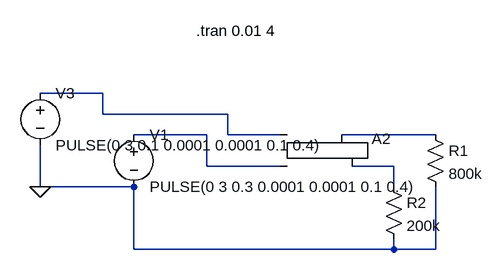
[diagram p0: schematic SRflipflop.asc]
SRflipflop.asc, the LTspice schematic file:
Version 4
SHEET 1 880 680
WIRE 32 128 -64 128
WIRE 32 160 32 128
WIRE 224 160 32 160
WIRE 192 192 80 192
WIRE 224 192 224 160
WIRE 304 192 224 192
WIRE 544 192 400 192
WIRE 192 240 192 192
WIRE 304 240 192 240
WIRE 480 240 416 240
WIRE -64 272 -64 208
WIRE 80 272 -64 272
WIRE 480 272 480 240
WIRE 80 368 80 272
WIRE 480 368 480 352
WIRE 480 368 80 368
WIRE 544 368 544 272
WIRE 544 368 480 368
FLAG -64 272 0
SYMBOL Digital/srflop 352 144 R0
SYMATTR InstName A2
SYMBOL voltage 80 176 R0
SYMATTR InstName V1
SYMATTR Value PULSE(0 3 0.3 0.0001 0.0001 0.1 0.4)
SYMBOL voltage -64 112 R0
SYMATTR InstName V3
SYMATTR Value PULSE(0 3 0.1 0.0001 0.0001 0.1 0.4)
SYMBOL res 528 176 R0
SYMATTR InstName R1
SYMATTR Value 800k
SYMBOL res 464 256 R0
SYMATTR InstName R2
SYMATTR Value 200k
TEXT 176 32 Left 2 !.tran 0.01 4

The netlist it stands for:
* SRflipflop.asc
A2 N001 N002 0 0 0 N004 N003 0 SRFLOP
V1 N002 0 PULSE(0 3 0.3 0.0001 0.0001 0.1 0.4)
V3 N001 0 PULSE(0 3 0.1 0.0001 0.0001 0.1 0.4)
R1 N003 0 800k
R2 N004 0 200k
.tran 0.01 4
.backanno
.end